# Altium schematic sheet SCP_Controller.SchDoc: SCP Fiber Controller (part 1 of 2)
size A4; Date: 15 Jan 2020; Author: Konstantin Borissov; CompanyName: UBC; DrawnBy: Konstantin Borissov; Organization: Molecular Mechatronics Laboratory; Revision: Rev. A; SheetNumber: 1; SheetTotal: 1
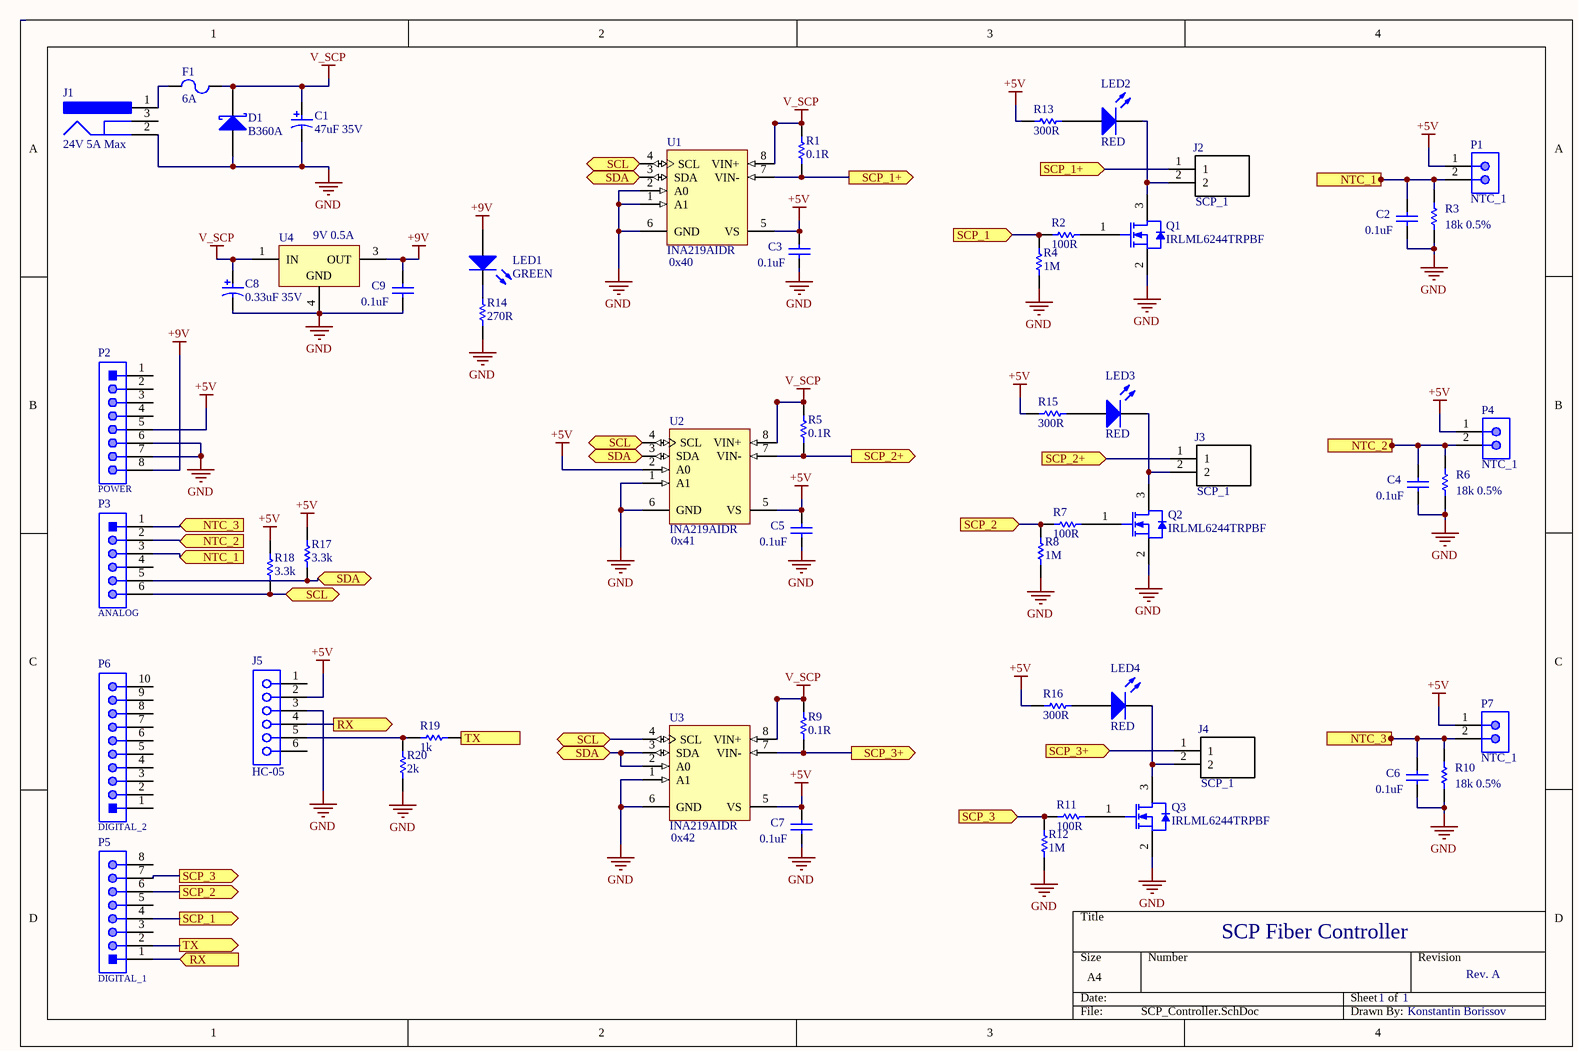
[diagram p0: SCP_Controller.SchDoc]

## Parts
C1  47uF 35V  [PNSC-FP-V-D_V]
C2  0.1uF  [CAPC1608X90X35NL10T15]
C3  0.1uF  [CAPC1608X90X35NL10T15]
C4  0.1uF  [CAPC1608X90X35NL10T15]
C5  0.1uF  [CAPC1608X90X35NL10T15]
C6  0.1uF  [CAPC1608X90X35NL10T15]
C7  0.1uF  [CAPC1608X90X35NL10T15]
C8  0.33uF 35V  [KEMT-A-3216-18-2_M]
C9  0.1uF  [CAPC1608X90X35NL10T15]
D1  B360A  [DIOD-B360A_V]
F1  6A  [LFUS-0468001.NR_V]
J1  24V 5A Max  [CUI-PJ-102A_V]
J2  SCP_1  [*CUI_TBP02R1-381-02BE]
J3  SCP_1  [*CUI_TBP02R1-381-02BE]
J4  SCP_1  [*CUI_TBP02R1-381-02BE]
J5  HC-05  [SMTC-SSW-106-02-X-S]
LED1  GREEN  [0603_A]
LED2  RED  [0603_A]
LED3  RED  [0603_A]
LED4  RED  [0603_A]
P1  NTC_1  [JST-B2B-XH-A_V]
P2  POWER  [61300811121]
P3  ANALOG  [61300611121]
P4  NTC_1  [JST-B2B-XH-A_V]
P5  DIGITAL_1  [61300811121]
P6  DIGITAL_2  [61301011121]
P7  NTC_1  [JST-B2B-XH-A_V]
Q1  IRLML6244TRPBF  [INTR-SOT23-3_V]
Q2  IRLML6244TRPBF  [INTR-SOT23-3_V]
Q3  IRLML6244TRPBF  [INTR-SOT23-3_V]
R1  0.1R  [RESC6432X89X76LL25T25]
R2  100R  [RESC2013X60X35ML10T20]
R3  18k 0.5%  [RESC2013X70X40NL20T20]
R4  1M  [RESC2013X70X40NL20T20]
R5  0.1R  [RESC6432X89X76LL25T25]
R6  18k 0.5%  [RESC2013X70X40NL20T20]
R7  100R  [RESC2013X60X35ML10T20]
R8  1M  [RESC2013X70X40NL20T20]
R9  0.1R  [RESC6432X89X76LL25T25]
R10  18k 0.5%  [RESC2013X70X40NL20T20]
R11  100R  [RESC2013X60X35ML10T20]
R12  1M  [RESC2013X70X40NL20T20]
R13  300R  [RESC2013X60X35LL10T20]
R14  270R  [RESC2013X60X35LL10T20]
R15  300R  [RESC2013X60X35LL10T20]
R16  300R  [RESC2013X60X35LL10T20]
R17  3.3k  [RESC2013X60X35ML10T20]
R18  3.3k  [RESC2013X60X35ML10T20]
R19  1k  [RESC2013X60X35ML10T20]
R20  2k  [RESC2013X60X35ML10T20]
U1  INA219AIDR  Address: 0x40  [D0008A_L]
U2  INA219AIDR  Address: 0x41  [D0008A_L]
U3  INA219AIDR  Address: 0x42  [D0008A_L]
U4  9V 0.5A  [TO-252_N]

## Ports
NTC_1 (in), NTC_1 (out), NTC_2 (in), NTC_2 (out), NTC_3 (in), NTC_3 (out), RX (in), RX (out), SCL (bidir), SCP_1 (in), SCP_1 (out), SCP_1+ (in), SCP_1+ (out), SCP_2 (in), SCP_2 (out), SCP_2+ (in), SCP_2+ (out), SCP_3 (in), SCP_3 (out), SCP_3+ (in), SCP_3+ (out), SDA (bidir), TX (in), TX (out)

## Nets
+5V: C3.1 C5.1 C7.1 J5.2 P1.1 P2.5 P4.1 P7.1 R13.1 R15.1 R16.1 R17.2 R18.2 U1.5(VS) U2.2(A0) U2.5(VS) U3.5(VS)
+9V: C9.1 LED1.2(A) P2.8 U4.3(OUT)
GND: C1.2 C2.2 C3.2 C4.2 C5.2 C6.2 C7.2 C8.2 C9.2 D1.1(A) J1.2 J5.3 P2.6 P2.7 Q1.2(S) Q2.2(S) Q3.2(S) R3.1 R4.1 R6.1 R8.1 R10.1 R12.1 R14.1 R20.1 U1.1(A1) U1.2(A0) U1.6(GND) U2.1(A1) U2.6(GND) U3.1(A1) U3.6(GND) U4.4(GND)
V_SCP: C1.1 C8.1 D1.2(K) F1.2 R1.2 R5.2 R9.2 U1.8(VIN+) U2.8(VIN+) U3.8(VIN+) U4.1(IN)
NTC_1: C2.1 P1.2 P3.3 R3.2 ; port NTC_1
NTC_2: C4.1 P3.2 P4.2 R6.2 ; port NTC_2
NTC_3: C6.1 P3.1 P7.2 R10.2 ; port NTC_3
RX: J5.4 P5.1 ; port RX
SCL: P3.6 R18.1 U1.4(SCL) U2.4(SCL) U3.4(SCL) ; port SCL
SCP_1: P5.4 R2.1 R4.2 ; port SCP_1
SCP_1+: J2.1 R1.1 U1.7(VIN-) ; port SCP_1+
SCP_2: P5.6 R7.1 R8.2 ; port SCP_2
SCP_2+: J3.1 R5.1 U2.7(VIN-) ; port SCP_2+
SCP_3: P5.7 R11.1 R12.2 ; port SCP_3
SCP_3+: J4.1 R9.1 U3.7(VIN-) ; port SCP_3+
SDA: P3.5 R17.1 U1.3(SDA) U2.3(SDA) U3.2(A0) U3.3(SDA) ; port SDA
TX: P5.2 R19.1 ; port TX
NetF1_1: F1.1 J1.1
NetJ2_2: J2.2 LED2.1(K) Q1.3(D)
NetJ3_2: J3.2 LED3.1(K) Q2.3(D)
NetJ4_2: J4.2 LED4.1(K) Q3.3(D)
NetJ5_5: J5.5 R19.2 R20.2
NetLED1_1: LED1.1(K) R14.2
NetLED2_2: LED2.2(A) R13.2
NetLED3_2: LED3.2(A) R15.2
NetLED4_2: LED4.2(A) R16.2
NetQ1_1: Q1.1(G) R2.2
NetQ2_1: Q2.1(G) R7.2
NetQ3_1: Q3.1(G) R11.2

Not connected (* = marked no-connect by the designer): J1 3(2); J5 1 6; P2 1 2 3 4; P3 4; P5 3 5 8; P6 1 2 3 4 5 6 7 8 9 10